# Altium schematic sheet LDO.SchDoc: Mini Editor Keyboard
size A3; DrawnBy: Roman Sklyar; Organization: S-LAB; Address1: Russian Federation; Address2: Sergiev Posad; DocumentNumber: 3; Revision: v1.0; SheetNumber: 3; SheetTotal: 6
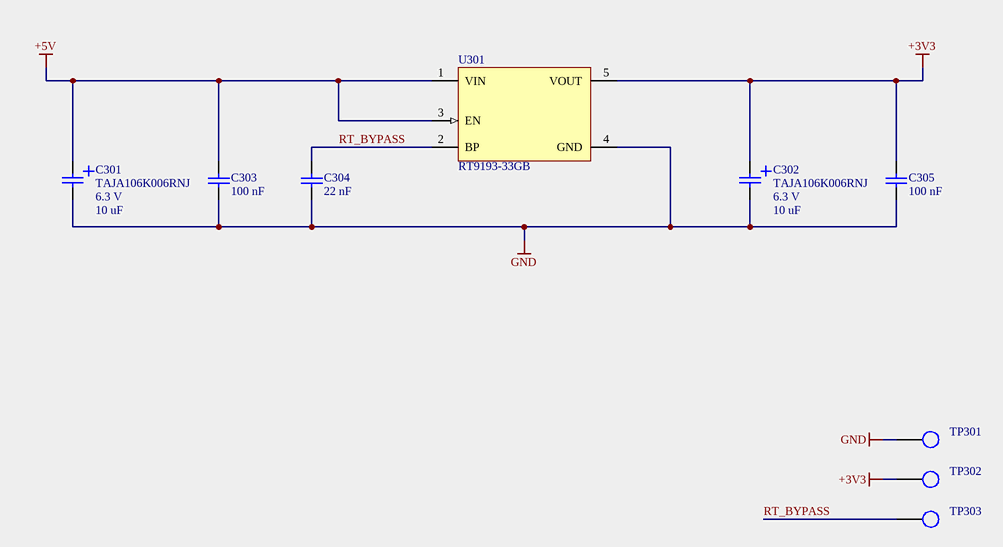
[diagram p0: LDO.SchDoc]

## Parts
C301  PartNumber: TAJA106K006RNJ  Voltage Rating: 6.3 V  Capacitance: 10 uF  [CAPMP-A-1206-3216X18]  (hidden comment: CAP-10U-6V3_A)
C302  PartNumber: TAJA106K006RNJ  Voltage Rating: 6.3 V  Capacitance: 10 uF  [CAPMP-A-1206-3216X18]  (hidden comment: CAP-10U-6V3_A)
C303  Capacitance: 100 nF  [CAPC0603]  (hidden comment: CAP-100N)
C304  Capacitance: 22 nF  [CAPC0603]  (hidden comment: CAP-22N)
C305  Capacitance: 100 nF  [CAPC0603]  (hidden comment: CAP-100N)
TP301  (no value)  [TP_C-0.5mm]  (no BOM)
TP302  (no value)  [TP_C-0.5mm]  (no BOM)
TP303  (no value)  [TP_C-0.5mm]  (no BOM)
U301  RT9193-33GB  [SOT-23-5-RICHTEK]

## Nets
+3V3: C302.1 C305.2 TP302.1 U301.5(VOUT)
+5V: C301.1 C303.2 U301.1(VIN) U301.3(EN)
GND: C301.2 C302.2 C303.1 C304.1 C305.1 TP301.1 U301.4(GND)
RT_BYPASS: C304.2 TP303.1 U301.2(BP)

## Notes on the sheet
- Title
- Size:
- Date:
- A3
- Number:
- Time:
- Revision:
- Sheet
- of
- File:

## Library data of the parts
C301 C302 = CAP-10U-6V3_A: 10uF ±10% 6.3V -55℃ ~ +125℃ Tantalum Capacitors; Mount: Surface Mount; Type: Tantalum Capacitor
C303 C305 = CAP-100N: Chip Capacitor, 100 nF, +/- 5%; Voltage Rating: 50 V; Mount: Surface Mount; Tolerance: 5 %; Type: Capacitor
C304 = CAP-22N: Chip Capacitor, 22 nF, +/- 5%; Voltage Rating: 50 V; Mount: Surface Mount; Tolerance: 5 %; Type: Capacitor
TP301-TP303 = TestPad
U301 = RT9193-33GB: Fixed 5.5V 3.3V 220mV @ 300mA SOT-23-5 Dropout Regulators(LDO); Type: LDO; Mount: Surface Mount; Package: SOT-23-5; PartNumber: RT9193-33GB